# Altium schematic sheet rear_ultrasonic_radar.SchDoc
size A3; SheetNumber: 6; SheetTotal: 6
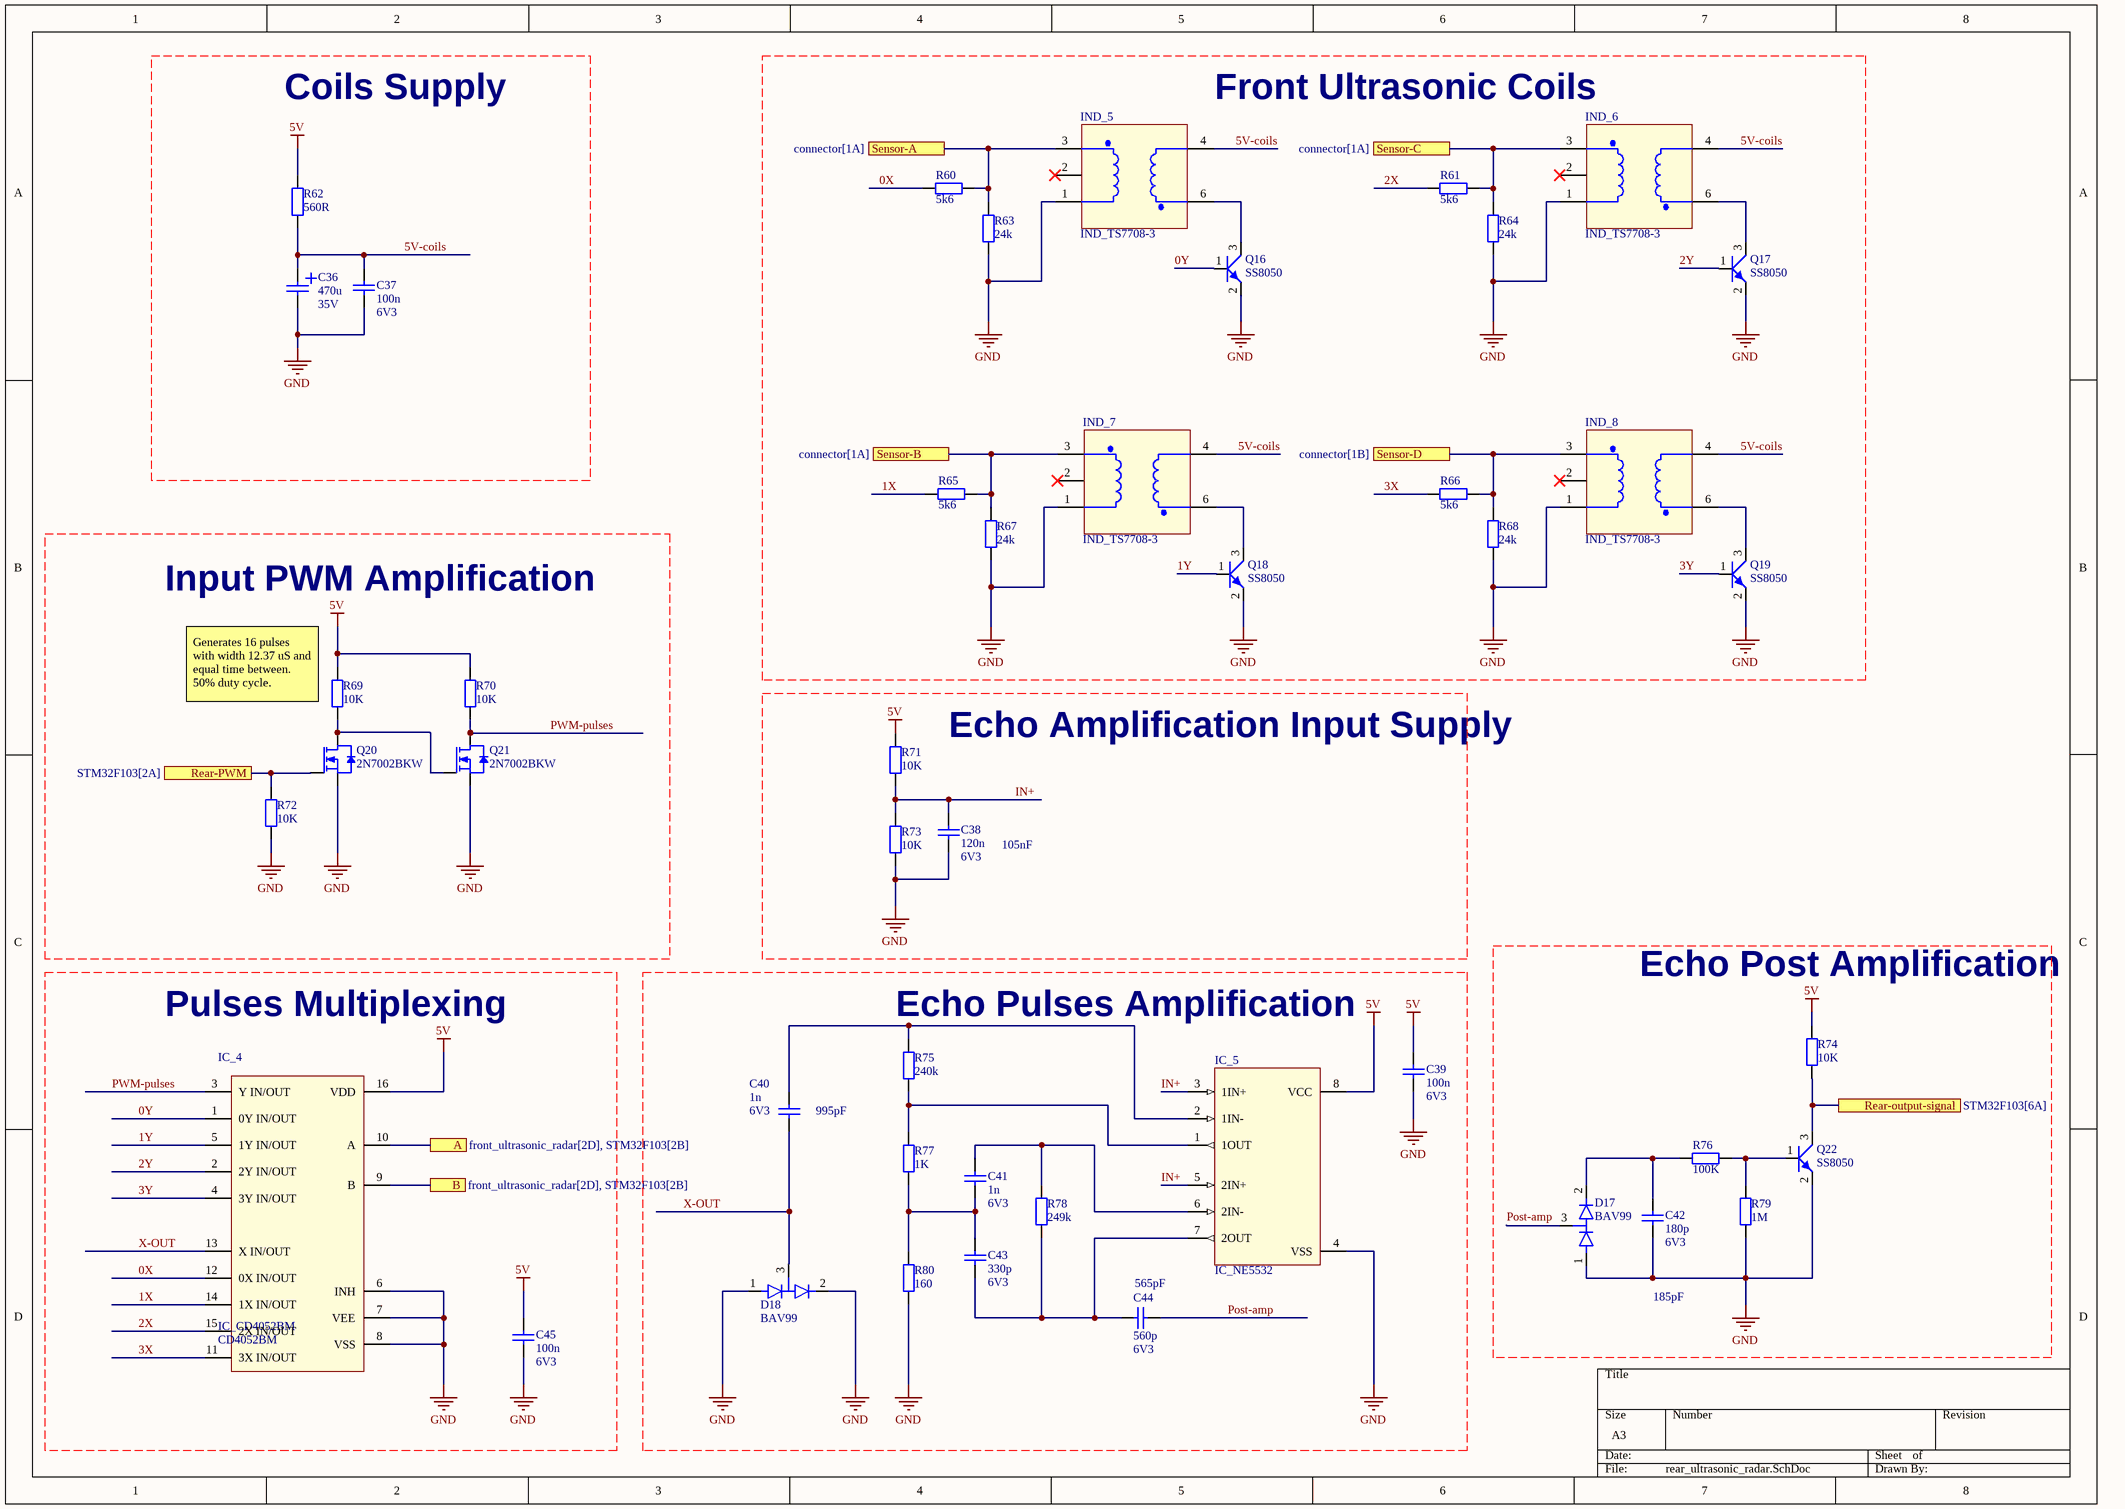
[diagram p0: rear_ultrasonic_radar.SchDoc]

## Parts
C36  Value1: 470u  Value2: 35V  [CAP_Panasonic_EEE-FK1V471SP]  (hidden comment: CAP_POL)
C37  Value1: 100n  Value2: 6V3  [CAPC2012X88N]  (hidden comment: CAP)
C38  Value1: 120n  Value2: 6V3  [CAPC2012X88N]  (hidden comment: CAP)
C39  Value1: 100n  Value2: 6V3  [CAPC2012X88N]  (hidden comment: CAP)
C40  Value1: 1n  Value2: 6V3  [CAPC2012X88N]  (hidden comment: CAP)
C41  Value1: 1n  Value2: 6V3  [CAPC2012X88N]  (hidden comment: CAP)
C42  Value1: 180p  Value2: 6V3  [CAPC2012X88N]  (hidden comment: CAP)
C43  Value1: 330p  Value2: 6V3  [CAPC2012X88N]  (hidden comment: CAP)
C44  Value1: 560p  Value2: 6V3  [CAPC2012X88N]  (hidden comment: CAP)
C45  Value1: 100n  Value2: 6V3  [CAPC2012X88N]  (hidden comment: CAP)
D17  Value1: BAV99  [DIO_BAV99-SOT23]  (hidden comment: High-speed double diode)
D18  Value1: BAV99  [DIO_BAV99-SOT23]  (hidden comment: High-speed double diode)
IC_4  IC_CD4052BM  Value1: CD4052BM  [SOP-16]
IC_5  IC_NE5532
IND_5  IND_TS7708-3
IND_6  IND_TS7708-3
IND_7  IND_TS7708-3
IND_8  IND_TS7708-3
Q16  Value1: SS8050  [SOT23]  (hidden comment: TRS_NPN_123)
Q17  Value1: SS8050  [SOT23]  (hidden comment: TRS_NPN_123)
Q18  Value1: SS8050  [SOT23]  (hidden comment: TRS_NPN_123)
Q19  Value1: SS8050  [SOT23]  (hidden comment: TRS_NPN_123)
Q20  Value1: 2N7002BKW  [SOT65P210X110-3N]  (hidden comment: TRS_FETN_123)
Q21  Value1: 2N7002BKW  [SOT65P210X110-3N]  (hidden comment: TRS_FETN_123)
Q22  Value1: SS8050  [SOT23]  (hidden comment: TRS_NPN_123)
R60  Value1: 5k6  [RESC2012X60N]  (hidden comment: RES)
R61  Value1: 5k6  [RESC2012X60N]  (hidden comment: RES)
R62  Value1: 560R  [RESC2012X60N]  (hidden comment: RES)
R63  Value1: 24k  [RESC2012X60N]  (hidden comment: RES)
R64  Value1: 24k  [RESC2012X60N]  (hidden comment: RES)
R65  Value1: 5k6  [RESC2012X60N]  (hidden comment: RES)
R66  Value1: 5k6  [RESC2012X60N]  (hidden comment: RES)
R67  Value1: 24k  [RESC2012X60N]  (hidden comment: RES)
R68  Value1: 24k  [RESC2012X60N]  (hidden comment: RES)
R69  Value1: 10K  [RESC2012X60N]  (hidden comment: RES)
R70  Value1: 10K  [RESC2012X60N]  (hidden comment: RES)
R71  Value1: 10K  [RESC2012X60N]  (hidden comment: RES)
R72  Value1: 10K  [RESC2012X60N]  (hidden comment: RES)
R73  Value1: 10K  [RESC2012X60N]  (hidden comment: RES)
R74  Value1: 10K  [RESC2012X60N]  (hidden comment: RES)
R75  Value1: 240k  [RESC2012X60N]  (hidden comment: RES)
R76  Value1: 100K  [RESC2012X60N]  (hidden comment: RES)
R77  Value1: 1K  [RESC2012X60N]  (hidden comment: RES)
R78  Value1: 249k  [RESC2012X60N]  (hidden comment: RES)
R79  Value1: 1M  [RESC2012X60N]  (hidden comment: RES)
R80  Value1: 160  [RESC2012X60N]  (hidden comment: RES)

## Ports
A (see front_ultrasonic_radar[2D], STM32F103[2B]), B (see front_ultrasonic_radar[2D], STM32F103[2B]), Rear-output-signal (see STM32F103[6A]), Rear-PWM (see STM32F103[2A]), Sensor-A (see connector[1A]), Sensor-B (see connector[1A]), Sensor-C (see connector[1A]), Sensor-D (see connector[1B])

## Nets
5V: C39.2 C45.2 IC_4.16(VDD) IC_5.8(VCC) R62.2 R69.2 R70.2 R71.1 R74.2
GND: C36.2 C37.1 C38.1 C39.1 C42.1 C45.1 D17.1(A1) D18.1(A1) D18.2(A2) IC_4.6(INH) IC_4.7(VEE) IC_4.8(VSS) IC_5.4(VSS) IND_5.1 IND_6.1 IND_7.1 IND_8.1 Q16.2(E) Q17.2(E) Q18.2(E) Q19.2(E) Q20.2(S) Q21.2(S) Q22.2(E) R63.1 R64.1 R67.1 R68.1 R72.1 R73.1 R79.1 R80.1
0X: IC_4.12(0X_IN/OUT) R60.2
0Y: IC_4.1(0Y_IN/OUT) Q16.1(B)
1X: IC_4.14(1X_IN/OUT) R65.2
1Y: IC_4.5(1Y_IN/OUT) Q18.1(B)
2X: IC_4.15(2X_IN/OUT) R61.2
2Y: IC_4.2(2Y_IN/OUT) Q17.1(B)
3X: IC_4.11(3X_IN/OUT) R66.2
3Y: IC_4.4(3Y_IN/OUT) Q19.1(B)
5V-coils: C36.1 C37.2 IND_5.4 IND_6.4 IND_7.4 IND_8.4 R62.1
A: IC_4.10(A) ; port A
B: IC_4.9(B) ; port B
IN+: C38.2 IC_5.3(1IN+) IC_5.5(2IN+) R71.2 R73.2
Post-amp: C44.1 D17.3(K)
PWM-pulses: IC_4.3(Y_IN/OUT) Q21.3(D) R70.1
Rear-output-signal: Q22.3(C) R74.1 ; port Rear-output-signal
Rear-PWM: Q20.1(G) R72.2 ; port Rear-PWM
Sensor-A: IND_5.3(S2) R60.1 R63.2 ; port Sensor-A
Sensor-B: IND_7.3(S2) R65.1 R67.2 ; port Sensor-B
Sensor-C: IND_6.3(S2) R61.1 R64.2 ; port Sensor-C
Sensor-D: IND_8.3(S2) R66.1 R68.2 ; port Sensor-D
X-OUT: C40.1 D18.3(K) IC_4.13(X_IN/OUT)
NetC40_2: C40.2 IC_5.2(1IN-) R75.1
NetC41_1: C41.1 IC_5.6(2IN-) R78.1
NetC41_2: C41.2 C43.2 R77.1 R80.2
NetC42_2: C42.2 D17.2(A2) R76.1
NetC43_1: C43.1 C44.2 IC_5.7(2OUT) R78.2
NetIC_5_1: IC_5.1(1OUT) R75.2 R77.2
NetIND_5_6: IND_5.6(S1) Q16.3(C)
NetIND_6_6: IND_6.6(S1) Q17.3(C)
NetIND_7_6: IND_7.6(S1) Q18.3(C)
NetIND_8_6: IND_8.6(S1) Q19.3(C)
NetQ20_3: Q20.3(D) Q21.1(G) R69.1
NetQ22_1: Q22.1(B) R76.2 R79.2

Not connected (* = marked no-connect by the designer): IND_5 2*; IND_6 2*; IND_7 2*; IND_8 2*

## Notes on the sheet
- Coils Supply
- Front Ultrasonic Coils
- Input PWM Amplification
- (near R69) Generates 16 pulses with width 12.37 uS and equal time between. 50% duty cycle.
- Echo Amplification Input Supply
- (near C38) 105nF
- (near R74) Echo Post Amplification
- Pulses Multiplexing
- (near R75) Echo Pulses Amplification
- (near C40) 995pF
- (near C44) 565pF
- 185pF

## Library data of the parts
C36 = 01_01555: Aluminium Electrolytic Capacitors - SMD 35volts 470uF SMD AEC-Q200 Reflow Only; Manufacturer: Panasonic; Manufacturer PN: EEE-FK1V471SP; AutoId: 1556; SubType: Electrolyte; Id: 01_01555; DeviceType: capacitor; Status: 0 - Unchecked; MountType: SMT; ComponentLink1URL: X:\01_Datasheets\CAP_Panasonic_FKS.pdf; Supplier 1: Mouser; Supplier Part Number 1: 667-EEE-FK1V471SP; ComponentLink1Description: Datasheet
C37 C39 C45 = 01_00637: X7R 10% 0805; Manufacturer: KEMET; Manufacturer PN: C0805C104K9RACTU; AutoId: 637; DeviceType: capacitor; SubType: Ceramic; Id: 01_00637; Status: 2 - Checked and Approved; MountType: SMT; ComponentLink1URL: X:\01_Datasheets\CAP_KEMET_CxxxxCxxxXxRAC.pdf; Supplier 1: Farnell; Supplier Part Number 1: 80-C0805C104K9R; ComponentLink1Description: Datasheet
C38 = 01_00638: X7R 10% 0805; Manufacturer: KEMET; Manufacturer PN: C0805C124K9RACTU; AutoId: 638; DeviceType: capacitor; SubType: Ceramic; Id: 01_00638; Status: 2 - Checked and Approved; MountType: SMT; ComponentLink1URL: X:\01_Datasheets\CAP_KEMET_CxxxxCxxxXxRAC.pdf; Supplier 1: Farnell; ComponentLink1Description: Datasheet
C40 C41 = 01_00613: X7R 10% 0805; Manufacturer: KEMET; Manufacturer PN: C0805C102K9RACTU; AutoId: 613; DeviceType: capacitor; SubType: Ceramic; Id: 01_00613; Status: 2 - Checked and Approved; MountType: SMT; ComponentLink1URL: X:\01_Datasheets\CAP_KEMET_CxxxxCxxxXxRAC.pdf; Supplier 1: Farnell; ComponentLink1Description: Datasheet
C42 = 01_00604: X7R 10% 0805; Manufacturer: KEMET; Manufacturer PN: C0805C181K9RACTU; AutoId: 604; DeviceType: capacitor; SubType: Ceramic; Id: 01_00604; Status: 2 - Checked and Approved; MountType: SMT; ComponentLink1URL: X:\01_Datasheets\CAP_KEMET_CxxxxCxxxXxRAC.pdf; Supplier 1: Farnell; ComponentLink1Description: Datasheet
C43 = 01_00607: X7R 10% 0805; Manufacturer: KEMET; Manufacturer PN: C0805C331K9RACTU; AutoId: 607; DeviceType: capacitor; SubType: Ceramic; Id: 01_00607; Status: 2 - Checked and Approved; MountType: SMT; ComponentLink1URL: X:\01_Datasheets\CAP_KEMET_CxxxxCxxxXxRAC.pdf; Supplier 1: Farnell; ComponentLink1Description: Datasheet
C44 = 01_00610: X7R 10% 0805; Manufacturer: KEMET; Manufacturer PN: C0805C561K9RACTU; AutoId: 610; DeviceType: capacitor; SubType: Ceramic; Id: 01_00610; Status: 2 - Checked and Approved; MountType: SMT; ComponentLink1URL: X:\01_Datasheets\CAP_KEMET_CxxxxCxxxXxRAC.pdf; Supplier 1: Farnell; ComponentLink1Description: Datasheet
D17 D18 = 03_00102: Manufacturer: Philips; AutoId: 120; Value2: 75В 215mА; Value3: Ultra fast; Id: 03_00102; Manufacturer PN: BAV99; DeviceType: diode; Status: 0 - Unchecked; MountType: SMD; ComponentLink1Description: Datasheet; ComponentLink1URL: X:\01_Datasheets\BAV99.pdf; ComponentLink2Description: ComponentVerificationSheet; ComponentLink2URL: X:\02_ComponentVerificationSheets\
IC_4 = 07_00294: Dual 4-Channel Analog Multiplexer/Demultiplexer; Manufacturer: Texas Instruments; AutoId: 301; Value2: 16 pin  Multiplexer/Demultiplexer; DeviceType: IC; Id: 07_00294; Manufacturer PN: CD4052BM; Status: 0 - Unchecked; MountType: SMT; ComponentLink1Description: Datasheet; ComponentLink1URL: X:\01_Datasheets\IC_CD4052BM.pdf; ComponentLink2Description: ComponentVerificationSheet; ComponentLink2URL: X:\02_ComponentVerificationSheets\
IC_5 = IC_NE5532: Dual low-noise operational amplifier 
IND_5-IND_8 = IND_TS7708-3: 12times Amplifying Transformer,IFT Inductors for Ultrasonic Sensors
Q16-Q19 Q22 = 19_00050: Bipolar Transistors - BJT NPN TRANSISTOR 1.5A 40V; Manufacturer: KooChin; AutoId: 57; Value2: 40V 1,5A; Id: 19_00050; Manufacturer PN: SS8050; DeviceType: transistor; SubType: NPN; Status: 0 - Unchecked; MountType: SMT; ComponentLink1Description: Datasheet; ComponentLink1URL: X:\01_Datasheets\SS8050.pdf; ComponentLink2Description: ComponentVerificationSheet; ComponentLink2URL: X:\02_ComponentVerificationSheets\
Q20 Q21 = 19_00024: NXP - 2N7002BKW - MOSFET, N CH, 60V, 0.31A, SOT323; AutoId: 24; DeviceType: transistor; Id: 19_00024; Value2: n/a; Manufacturer: NXP; Manufacturer PN: 2N7002BKW; SubType: MOSFET; Status: 2 - Checked and Approved; MountType: SMD; ComponentLink1Description: Datasheet; ComponentLink1URL: X:\01_dataSheets\TRS_NXP_2N7002BKW.pdf; ComponentLink2Description: ComponentVerificationSheet; ComponentLink2URL: X:\02_ComponentVerificationSheets\; Supplier 1: Farnell; Supplier Part Number 1: 1894713RL
R60 R61 R65 R66 = 15_10611: RESISTOR, 0805, 5k6, 1%, SMD; Manufacturer: Yageo; AutoId: 674; Value2: 0W125; SubType: Metal film; Id: 15_10611; DeviceType: resistor; Status: 0 - Unchecked; MountType: SMT; ComponentLink1Description: Datasheet; ComponentLink1URL: X:\01_Datasheets\
R62 = 15_00326: RESISTOR, 0805, 560R, 1%, SMD; Manufacturer: Yageo; Manufacturer PN: RC0805FR-07560R; AutoId: 326; Value2: 0W125; SubType: Metal film; Id: 15_00326; DeviceType: resistor; Status: 2 - Checked and Approved; MountType: SMT; ComponentLink1Description: Datasheet; ComponentLink1URL: X:\01_Datasheets\RES_YAGEO_RC0805FR.pdf; Supplier 1: Farnell; Supplier Part Number 1: 9237461
R63 R64 R67 R68 = 15_10610: RESISTOR, 0805, 24k, 1%, SMD; Manufacturer: Yageo; AutoId: 673; Value2: 0W125; SubType: Metal film; Id: 15_10610; DeviceType: resistor; Status: 0 - Unchecked; MountType: SMT; ComponentLink1Description: Datasheet; ComponentLink1URL: X:\01_Datasheets\
R69-R74 = 15_00341: RESISTOR, 0805, 10K, 1%, SMD; Manufacturer: Yageo; Manufacturer PN: RC0805FR-0710K; AutoId: 341; Value2: 0W125; SubType: Metal film; Id: 15_00341; DeviceType: resistor; Status: 0 - Unchecked; MountType: SMT; ComponentLink1Description: Datasheet; ComponentLink1URL: X:\01_Datasheets\RES_YAGEO_RC0805FR.pdf; Supplier 1: Farnell
R75 = 15_10613: RESISTOR, 0805, 240k, 1%, SMD; Manufacturer: Yageo; AutoId: 676; Value2: 0W125; SubType: Metal film; Id: 15_10613; DeviceType: resistor; Status: 0 - Unchecked; MountType: SMT; ComponentLink1Description: Datasheet; ComponentLink1URL: X:\01_Datasheets\
R76 = 15_00353: RESISTOR, 0805, 100K, 1%, SMD; Manufacturer: Yageo; Manufacturer PN: RC0805FR-07100K; AutoId: 353; Value2: 0W125; SubType: Metal film; Id: 15_00353; DeviceType: resistor; Status: 0 - Unchecked; MountType: SMT; ComponentLink1Description: Datasheet; ComponentLink1URL: X:\01_Datasheets\RES_YAGEO_RC0805FR.pdf; Supplier 1: Farnell
R77 = 15_00329: RESISTOR, 0805, 1K, 1%, SMD; Manufacturer: Yageo; Manufacturer PN: RC0805FR-071K; AutoId: 329; Value2: 0W125; SubType: Metal film; Id: 15_00329; DeviceType: resistor; Status: 2 - Checked and Approved; MountType: SMT; ComponentLink1Description: Datasheet; ComponentLink1URL: X:\01_Datasheets\RES_YAGEO_RC0805FR.pdf; Supplier 1: Farnell; Supplier Part Number 1: 9237496
R78 = 15_10614: RESISTOR, 0805, 249k, 1%, SMD; Manufacturer: Yageo; AutoId: 677; Value2: 0W125; SubType: Metal film; Id: 15_10614; DeviceType: resistor; Status: 0 - Unchecked; MountType: SMT; ComponentLink1Description: Datasheet; ComponentLink1URL: X:\01_Datasheets\
R79 = 15_00365: RESISTOR, 0805, 1M, 1%, SMD; Manufacturer: Yageo; Manufacturer PN: RC0805FR-071M; AutoId: 365; Value2: 0W125; SubType: Metal film; Id: 15_00365; DeviceType: resistor; Status: 0 - Unchecked; MountType: SMT; ComponentLink1Description: Datasheet; ComponentLink1URL: X:\01_Datasheets\RES_YAGEO_RC0805FR.pdf; Supplier 1: Farnell
R80 = 15_10612: RESISTOR, 0805, 160, 1%, SMD; Manufacturer: Yageo; AutoId: 675; Value2: 0W125; SubType: Metal film; Id: 15_10612; DeviceType: resistor; Status: 0 - Unchecked; MountType: SMT; ComponentLink1Description: Datasheet; ComponentLink1URL: X:\01_Datasheets\